# EasyEDA Pro project ProPrj_Animatronic Bird Control Carrier Board_2026-03-15.epro

# Schematic Schematic1
Board Name: Board1; Create Date: 2026-03-13; Page Name: P1; Project Name: Animatronic Bird Control Carrier Board; Schematic Name: Schematic1; Update Date: 2026-03-12; Company: EasyEDA.com; Page Size: A4; Version: V1.0
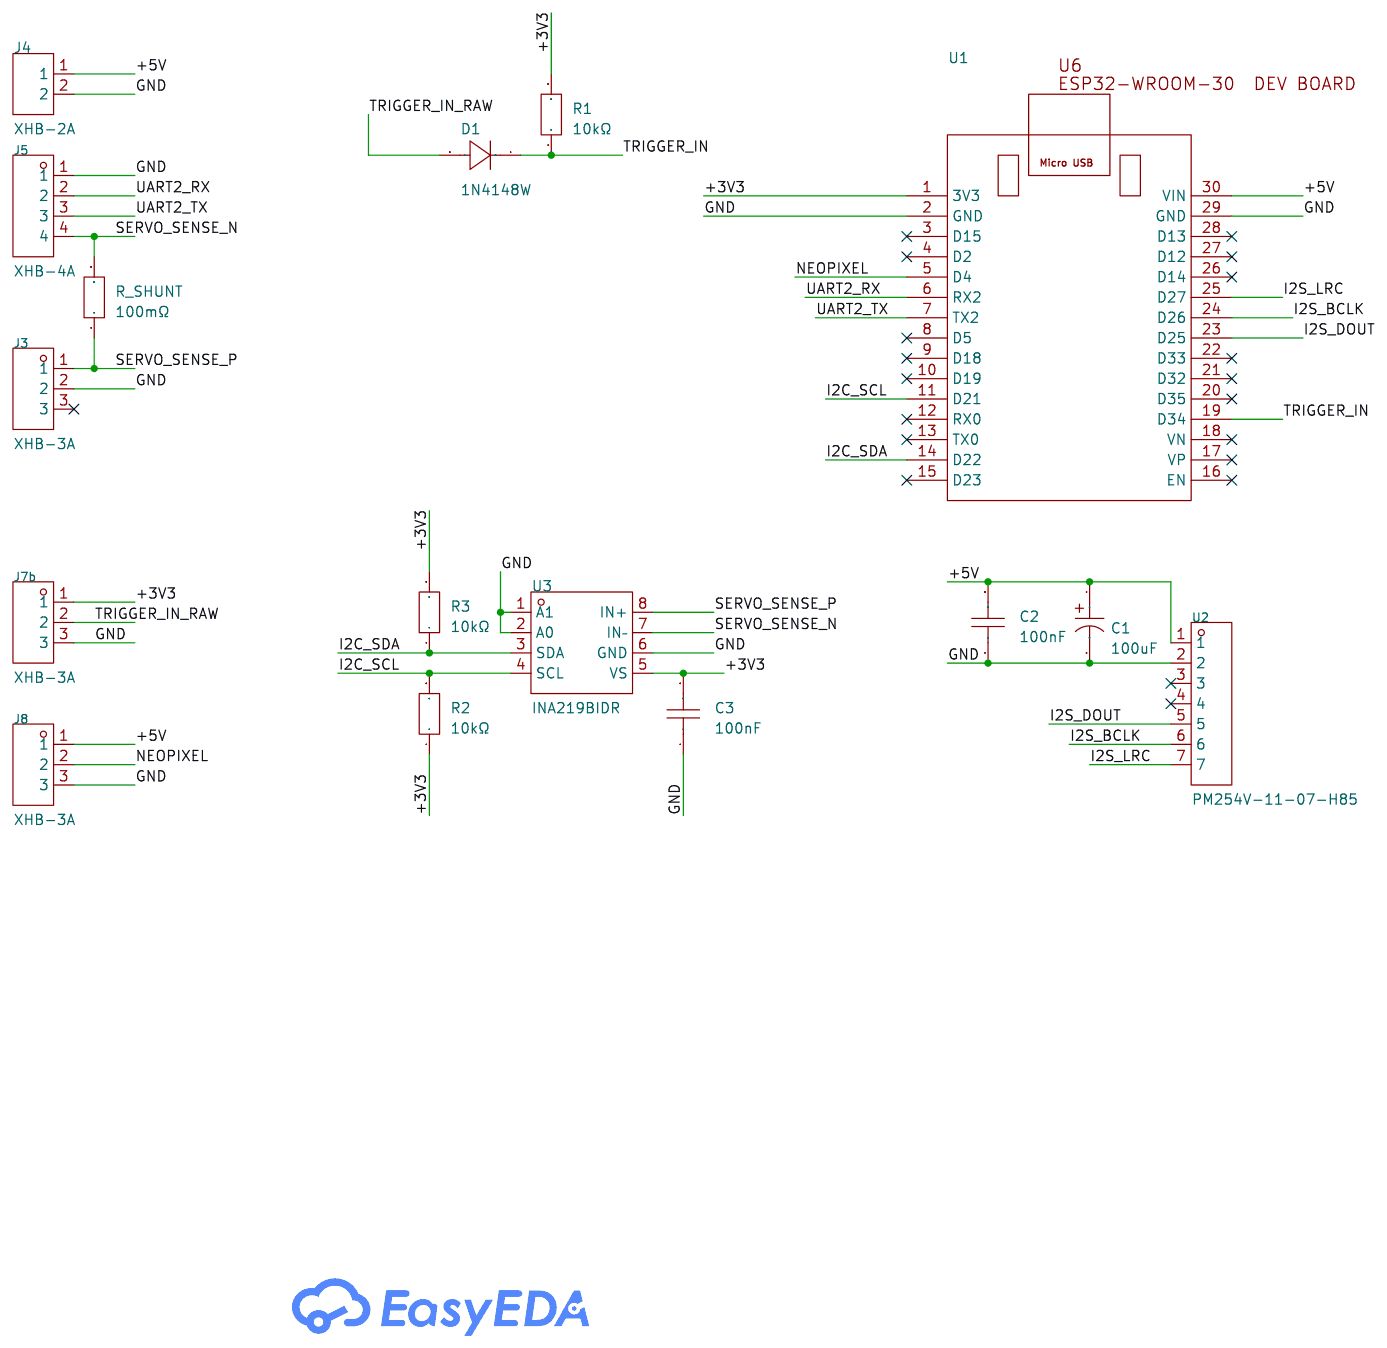
[diagram p0: schematic sheet]

## Parts
C1  100uF  [CAP-SMD_BD6.3-L6.6-W6.6-FD]
C2  100nF  [C0603]
C3  100nF  [C0603]
D1  1N4148W  [SOD-123_L2.8-W1.8-LS3.7-RD-1]
J3  XHB-3A  [CONN-TH_XHB-3A]
J4  XHB-2A  [CONN-TH_XHB-2A_C2829622]
J5  XHB-4A  [CONN-TH_4P-P2.50_HCTL_HC-XHB-4A]
J7b  XHB-3A  [CONN-TH_XHB-3A]
J8  XHB-3A  [CONN-TH_XHB-3A]
R1  10kΩ  [R0603]
R2  10kΩ  [R0603]
R3  10kΩ  [R0603]
R_SHUNT  100mΩ  [R2512]
U1  -  [ESP32-WROOM-30-DEVBOARD]
U2  PM254V-11-07-H85  [HDR-TH_7P-P2.54-V-F]
U3  INA219BIDR  [SOIC-8_L5.0-W4.0-P1.27-LS6.1-BL]

## Library data of the parts
C1 = RST100UF16V003: Capacitance:100uF Tolerance:±20% Tolerance:±20% Voltage Rating:16V Ripple Current:60mA@120Hz Equivalent Series Resistance(ESR):- Diameter:6.3mm Height - Seated (Max):5.4mm Lifetime:2000hrs@105℃ Operating Temperature:-40℃~+105℃ Operating Temperature:-40℃~+; LCSC Part Name: 100uF ±20% 16V; Supplier Part: C4747963; Manufacturer: KNSCHA(科尼盛); Supplier Footprint: SMD,D6.3xL5.4mm; JLCPCB Part Class: Extended Part; Datasheet: https://item.szlcsc.com/datasheet/RST100UF16V003/5320090.html; Supplier: LCSC; Tolerance: ±20%; Voltage Rating: 16V; Ripple Current: 60mA@120Hz; Diameter: 6.3mm; Height - Seated (Max): 5.4mm; Lifetime: 2000hrs@105℃; Operating Temperature: -40℃~+105℃
C2 C3 = CC0603KRX7R9BB104: Capacitance:100nF Tolerance:±10% Tolerance:±10% Voltage Rating:50V Temperature Coefficient:X7R; LCSC Part Name: 100nF ±10% 50V; Supplier Part: C14663; Manufacturer: YAGEO(国巨); Supplier Footprint: 0603; JLCPCB Part Class: Basic Part; Datasheet: https://item.szlcsc.com/datasheet/CC0603KRX7R9BB104/15331.html; Supplier: LCSC; Tolerance: ±10%; Voltage Rating: 50V; Temperature Coefficient: X7R
D1 = 1N4148W_C917030: Diode Configuration:Independent Voltage - Forward(Vf@If):1.25V@150mA Voltage - DC Reverse(Vr):100V Current - Rectified:300mA Pd - Power Dissipation:400mW Reverse Leakage Current (Ir):1uA@75V Reverse Recovery Time (trr):8ns Operating Junction Temperature R; Supplier Part: C917030; Manufacturer: JSMSEMI(杰盛微); Supplier Footprint: SOD-123; JLCPCB Part Class: Extended Part; Datasheet: https://item.szlcsc.com/datasheet/1N4148W/991526.html; Supplier: LCSC; Diode Configuration: Independent; Voltage - Forward(Vf@If): 1.25V@150mA; Voltage - DC Reverse(Vr): 100V; Current - Rectified: 300mA; Pd - Power Dissipation: 400mW; Reverse Leakage Current (Ir): 1uA@75V; Reverse Recovery Time (trr): 8ns; Operating Junction Temperature Range: -55℃~+150℃@(Tj); Non-Repetitive Peak Forward Surge Current: 4A
J3 J7b J8 = XHB-3A_C722899: Pins Structure:1x3P Pitch:2.5mm Mounting Type:Through Hole Reference Series:XHB Number of Pins:3P Number of Rows:1 Number of PINs Per Row:3 Row Spacing:- Current Rating:- Contact Material:Brass Contact Plating:Tin Operating Temperature:- Operating Tempera; LCSC Part Name: 1x3P 间距:2.5mm 直插 系列:XHB; Supplier Part: C722899; Manufacturer: CAX(创都); Supplier Footprint: 插件,P=2.5mm; JLCPCB Part Class: Extended Part; Datasheet: https://item.szlcsc.com/datasheet/XHB-3A/767106.html; Supplier: LCSC; Pins Structure: 1x3P; Pitch: 2.5mm; Mounting Type: Through Hole; Reference Series: XHB; Number of Pins: 3P; Number of Rows: 1; Number of PINs Per Row: 3; Contact Material: Brass; Contact Plating: Tin; Plastic Material: PA66; Flame Retardant Rating: UL94V-0; Color: White; Z-Height of the Board: 7mm; X-Length of Bottom Edge on Board (Spacing Line): 10mm; Y-Width of Bottom Edge on Board: 5.8mm
J4 = XHB-2A: Pins Structure:1x2P Pitch:2.5mm Mounting Type:Through Hole Reference Series:XHB Number of Pins:2P Number of Rows:1 Number of PINs Per Row:2 Current Rating:3A Operating Temperature:-25℃~+85℃ Operating Temperature:-25℃~+85℃ Voltage Rating:250V Color:White Z; LCSC Part Name: 1x2P 间距:2.5mm 直插 系列:XHB; Supplier Part: C2829622; Manufacturer: FG(富港); Supplier Footprint: 插件,P=2.5mm; JLCPCB Part Class: Extended Part; Datasheet: https://item.szlcsc.com/datasheet/XHB-2A/2980249.html; Supplier: LCSC; Pins Structure: 1x2P; Pitch: 2.5mm; Mounting Type: Through Hole; Reference Series: XHB; Number of Pins: 2P; Number of Rows: 1; Number of PINs Per Row: 2; Current Rating: 3A; Operating Temperature: -25℃~+85℃; Voltage Rating: 250V; Color: White; Z-Height of the Board: 7.1mm; X-Length of Bottom Edge on Board (Spacing Line): 7.5mm; Y-Width of Bottom Edge on Board: 6.35mm
J5 = XHB-4A_C2904971: Pins Structure:1x4P Pitch:2.5mm Mounting Type:Through Hole Reference Series:XHB Number of Pins:4P Number of Rows:1 Number of PINs Per Row:4 Row Spacing:- Current Rating:- Operating Temperature:-25℃~+85℃ Operating Temperature:-25℃~+85℃ Voltage Rating:50V Z; LCSC Part Name: 1x4P 间距:2.5mm 直插 系列:XHB; Supplier Part: C2904971; Manufacturer: DEALON(德艺隆); Supplier Footprint: 插件,P=2.5mm; JLCPCB Part Class: Extended Part; Datasheet: https://item.szlcsc.com/datasheet/XHB-4A/3172256.html; Supplier: LCSC; Pins Structure: 1x4P; Pitch: 2.5mm; Mounting Type: Through Hole; Reference Series: XHB; Number of Pins: 4P; Number of Rows: 1; Number of PINs Per Row: 4; Operating Temperature: -25℃~+85℃; Voltage Rating: 50V; Z-Height of the Board: 7mm; X-Length of Bottom Edge on Board (Spacing Line): 12.5mm; Y-Width of Bottom Edge on Board: 5.8mm
R1-R3 = FRC0603J103 TS: Type:Thick Film Resistor Resistance:10kΩ Tolerance:±5% Tolerance:±5% Power(Watts):100mW Voltage-Supply(Max):75V Temperature Coefficient:±100ppm/℃ Temperature Coefficient:±100ppm/℃ Operating Temperature:-55℃~+155℃ Operating Temperature:-55℃~+155℃; LCSC Part Name: 10kΩ ±5% 100mW 厚膜电阻; Supplier Part: C2930027; Manufacturer: FOJAN(富捷); Supplier Footprint: 0603; JLCPCB Part Class: Extended Part; Datasheet: https://item.szlcsc.com/datasheet/FRC0603J103%2520TS/3266960.html; Supplier: LCSC; Type: Thick Film Resistor; Tolerance: ±5%; Power(Watts): 100mW; Voltage-Supply(Max): 75V; Temperature Coefficient: ±100ppm/℃; Operating Temperature: -55℃~+155℃
R_SHUNT = LRP12FTDSR100: Resistance:100mΩ Tolerance:±1% Tolerance:±1% Power(Watts):2W Temperature Coefficient:±50ppm/℃ Temperature Coefficient:±50ppm/℃ Operating Temperature:-55℃~+170℃ Operating Temperature:-55℃~+170℃; LCSC Part Name: 100mΩ ±1% 2W; Supplier Part: C37635799; Manufacturer: Viking(光颉); Supplier Footprint: 2512; JLCPCB Part Class: Extended Part; Datasheet: https://item.szlcsc.com/datasheet/LRP12FTDSR100/39362056.html; Supplier: LCSC; Tolerance: ±1%; Power(Watts): 2W; Temperature Coefficient: ±50ppm/℃; Operating Temperature: -55℃~+170℃
U1 = ESP32-WROOM 30-pin dev board
U2 = PM254V-11-07-H85: Holes Structure:1x7P Pitch:2.54mm Row Spacing:- Circular Hole / Square Hole:Square Hole Mounting Type:Through Hole Number of Rows:1 Number of Positions:7P Current Rating:3A Voltage Rating (Max):250V Holes Direction:Top Insulation Height:- Operating Temper; LCSC Part Name: 间距:2.54mm 1x7P 直插; Supplier Part: C2832270; Manufacturer: XFCN(兴飞); Supplier Footprint: 插件,P=2.54mm; JLCPCB Part Class: Extended Part; Datasheet: https://item.szlcsc.com/datasheet/PM254V-11-07-H85/2989788.html; Supplier: LCSC; Holes Structure: 1x7P; Pitch: 2.54mm; Circular Hole / Square Hole: Square Hole; Mounting Type: Through Hole; Number of Rows: 1; Number of Positions: 7P; Current Rating: 3A; Voltage Rating (Max): 250V; Holes Direction: Top; Operating Temperature: -40℃~+105℃
U3 = INA219BIDR: Vcm - Common Mode Voltage:300mV~26V Vcm - Common Mode Voltage:300mV~26V Ib - Input Bias Current:- Vos - Input Offset Voltage:- Operating Temperature:-40℃~+125℃ Operating Temperature:-40℃~+125℃; LCSC Part Name: 具有I2C接口的零漂移双向电流/功率监测计; Supplier Part: C2155799; Manufacturer: TI(德州仪器); Supplier Footprint: SOIC-8; JLCPCB Part Class: Extended Part; Datasheet: https://www.ti.com/cn/lit/gpn/ina219; Supplier: LCSC; Vcm - Common Mode Voltage: 300mV~26V; Operating Temperature: -40℃~+125℃

## Nets
+3V3: C3.2 J7b.1 R1.2 R2.1 R3.2 U1.1(3V3) U3.5(VS)
+5V: C1.1 C2.2 J4.1 J8.1 U1.30(VIN) U2.1
GND: C1.2 C2.1 C3.1 J3.2 J4.2 J5.1 J7b.3 J8.3 U1.2(GND) U1.29(GND) U2.2 U3.1(A1) U3.2(A0) U3.6(GND)
I2C_SCL: R2.2 U1.11(D21) U3.4(SCL)
I2C_SDA: R3.1 U1.14(D22) U3.3(SDA)
I2S_BCLK: U1.24(D26) U2.6
I2S_DOUT: U1.23(D25) U2.5
I2S_LRC: U1.25(D27) U2.7
NEOPIXEL: J8.2 U1.5(D4)
SERVO_SENSE_N: J5.4 R_SHUNT.2 U3.7(IN–)
SERVO_SENSE_P: J3.1 R_SHUNT.1 U3.8(IN+)
TRIGGER_IN: D1.1(C) R1.1 U1.19(D34)
TRIGGER_IN_RAW: D1.2(A) J7b.2
UART2_RX: J5.2 U1.6(RX2)
UART2_TX: J5.3 U1.7(TX2)

Not connected (* = marked no-connect by the designer): J3 3*; U1 3(D15)* 4(D2)* 8(D5)* 9(D18)* 10(D19)* 12(RX0)* 13(TX0)* 15(D23)* 16(EN)* 17(VP)* 18(VN)* 20(D35)* 21(D32)* 22(D33)* 26(D14)* 27(D12)* 28(D13)*; U2 3* 4*

# Board PCB1
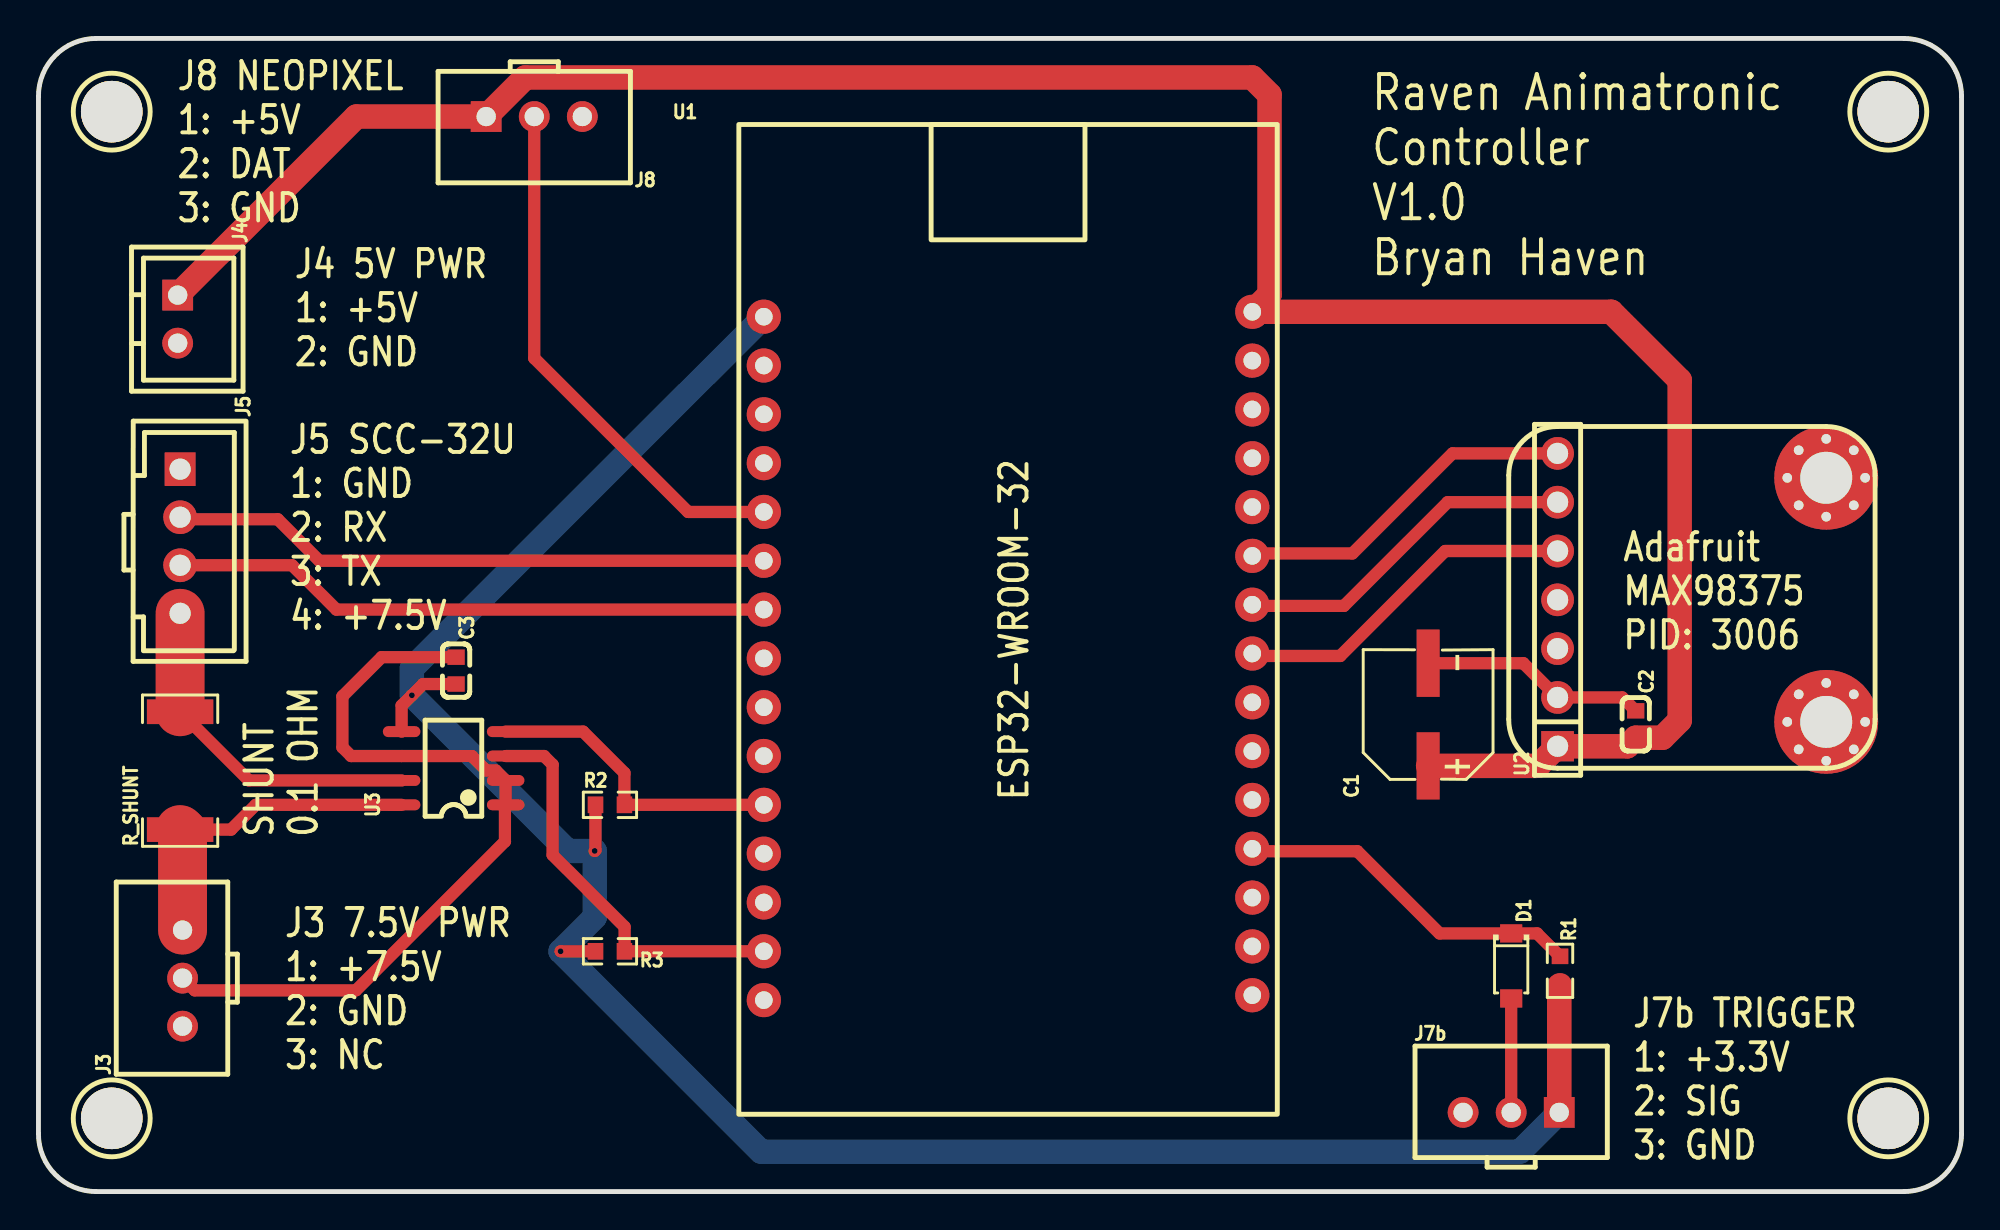
[diagram p1: board, top side]
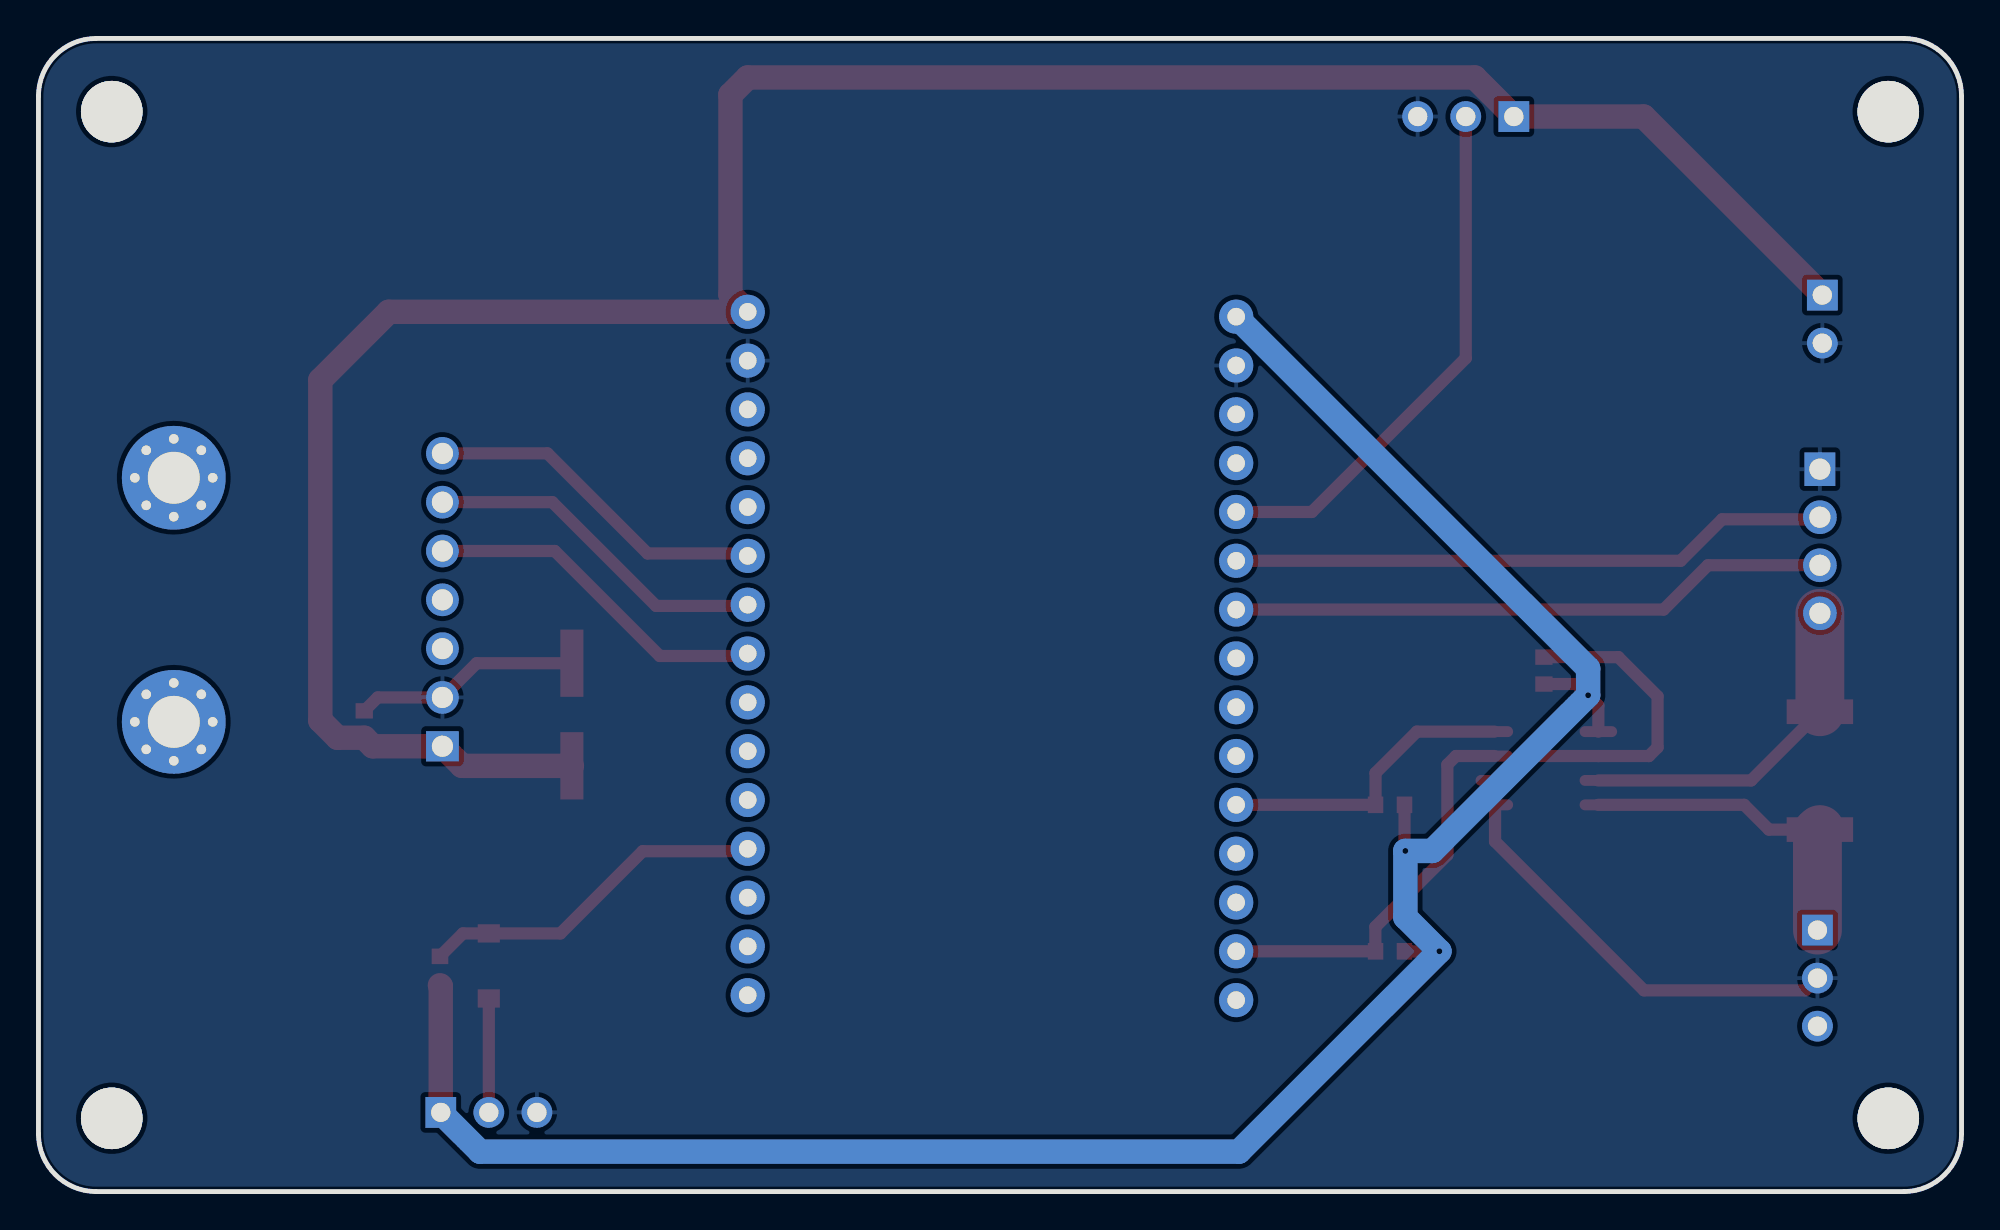
[diagram p2: board, bottom side, seen from below]

Outline 100 x 60 mm; copper layers: Top Layer, F.CrtYd, Cmts.User, Bottom Layer. Coordinates in mm from the lower left corner of the outline.
Outline path: 0,57 0,3 arc(0.88,0.88) 3,0 97,0 arc(99.12,0.88) 100,3 100,57 arc(99.12,59.12) 97,60 3,60 arc(0.88,59.12) 0,57
Stack: Top Layer 0.035mm / Dielectric1 1.51mm FR4 er 4.5 / F.CrtYd 0.035mm / Dielectric2 0.48mm PP er 4.5 / Cmts.User 0.035mm / Dielectric3 0.48mm PP er 4.5 / Bottom Layer 0.035mm

## Design rules (mm)
template: JLCPCB Capability(Two Layers Board)
spacing copperThickness1oz (default): track to track 0.102, other pairs 0.152 to 0.3
spacing copperThickness2oz: track to track 0.203, other pairs 0.152 to 0.3
track width copperThickness1oz (default): min 0.127, default 0.254, max 2.54
track width copperThickness2oz: min 0.203, default 0.254, max 2.54
differential pair differentialPair (default): width min 0.127, default 0.254, max 2.54; gap min 0.152, default 0.152
via viaSize (default): diameter min 0.5, default 0.61, max 10; hole min 0.3, default 0.305, max 6.3

## Placement (name value [footprint] x y rotation side)
C1  100uF  [CAP-SMD_BD6.3-L6.6-W6.6-FD]  72.26 24.82 90 top
C2  100nF  [C0603]  83.06 24.31 270 top
C3  100nF  [C0603]  21.72 27.11 270 top
D1  1N4148W  [SOD-123_L2.8-W1.8-LS3.7-RD-1]  76.58 11.74 270 top
J3  XHB-3A  [CONN-TH_XHB-3A]  7.49 11.1 90 top
J4  XHB-2A  [CONN-TH_XHB-2A_C2829622]  7.24 45.39 270 top
J5  XHB-4A  [CONN-TH_4P-P2.50_HCTL_HC-XHB-4A]  7.37 33.84 270 top
J7b  XHB-3A  [CONN-TH_XHB-3A]  76.58 4.12 0 top
J8  XHB-3A  [CONN-TH_XHB-3A]  25.78 55.94 180 top
R1  10kΩ  [R0603]  79.12 11.49 270 top
R2  10kΩ  [R0603]  29.72 20.12 0 top
R3  10kΩ  [R0603]  29.72 12.5 180 top
R_SHUNT  100mΩ  [R2512]  7.37 21.9 90 top
U1  -  [ESP32-WROOM-30-DEVBOARD]  37.72 45.52 0 top
U2  PM254V-11-07-H85  [HDR-TH_7P-P2.54-V-F]  78.99 30.79 90 top
U3  INA219BIDR  [SOIC-8_L5.0-W4.0-P1.27-LS6.1-BL]  21.59 22.03 90 top
U4  -  [MountingHole_3.2mm_M3]  96.19 56.19 0 top
U5  -  [MountingHole_3.2mm_M3]  96.19 3.81 0 top
U6  -  [MountingHole_3.2mm_M3]  3.81 3.81 0 top
U7  -  [MountingHole_3.2mm_M3]  3.81 56.19 0 top
U8  -  [MountingHole:MountingHole_2.7mm_M2.5_Pad_Via]  92.96 37.14 0 top
U9  -  [MountingHole:MountingHole_2.7mm_M2.5_Pad_Via]  92.96 24.44 0 top

## Footprints (pads in the part's own frame, mm; a bottom-side part is the same pattern mirrored in y, then rotated)
C0603
  rect 0.8x0.9 smd: 1(-0.7,0) 2(0.7,0)
CAP-SMD_BD6.3-L6.6-W6.6-FD
  rect 3.5x1.2 smd: 1(-2.67,0) 2(2.67,0)
CONN-TH_4P-P2.50_HCTL_HC-XHB-4A
  rect 1.75x1.6 hole 1.1: 1(-3.75,0)
  round 1.75 hole 1.1: 2(-1.25,0) 3(1.25,0) 4(3.75,0)
CONN-TH_XHB-2A_C2829622
  rect 1.6x1.6 hole 1: 1(-1.25,0)
  round 1.6 hole 1: 2(1.25,0)
CONN-TH_XHB-3A
  rect 1.6x1.6 hole 1: 1(2.5,0)
  round 1.6 hole 1: 2(0,0) 3(-2.5,0)
ESP32-WROOM-30-DEVBOARD
  round 1.778 hole 0.914: 1(0,0) 2(0,-2.54) 3(0,-5.08) 4(0,-7.62) 5(0,-10.16) 6(0,-12.7) 7(0,-15.24) 8(0,-17.78) 9(0,-20.32) 10(0,-22.86) 11(0,-25.4) 12(0,-27.94) 13(0,-30.48) 14(0,-33.02) 15(0,-35.56) 16(25.4,-35.306) 17(25.4,-32.766) 18(25.4,-30.226) 19(25.4,-27.686) 20(25.4,-25.146) 21(25.4,-22.606) 22(25.4,-20.066) 23(25.4,-17.526) 24(25.4,-14.986) 25(25.4,-12.446) 26(25.4,-9.906) 27(25.4,-7.366) 28(25.4,-4.826) 29(25.4,-2.286) 30(25.4,0.254)
HDR-TH_7P-P2.54-V-F
  rect 1.575x1.7 hole 1.1: 1(-7.62,0)
  round 1.7 hole 1.1: 2(-5.08,0) 3(-2.54,0) 4(0,0) 5(2.54,0) 6(5.08,0) 7(7.62,0)
MountingHole:MountingHole_2.7mm_M2.5_Pad_Via
  round 0.8 hole 0.5: 1(0,2.025) 2(2.025,0) 3(0,-2.025) 4(-1.432,1.432) 5(1.432,-1.432) 6(1.432,1.432) 7(-1.432,-1.432) 8(-2.025,0)
  round 5.4 hole 2.7: 9(0,0)
MountingHole_3.2mm_M3
  round 3.2 hole 3.2: (0,0)
R0603
  rect 0.806x0.864 smd: 1(-0.753,0) 2(0.753,0)
R2512
  rect 1.282x3.456 smd: 1(-3.067,0) 2(3.067,0)
SOD-123_L2.8-W1.8-LS3.7-RD-1
  rect 0.95x1.15 smd: 1(-1.692,0) 2(1.692,0)
SOIC-8_L5.0-W4.0-P1.27-LS6.1-BL
  oval 0.569x1.95 smd: 1(-1.905,-2.705) 2(-0.635,-2.705) 3(0.635,-2.705) 4(1.905,-2.705) 5(1.905,2.705) 6(0.635,2.705) 7(-0.635,2.705) 8(-1.905,2.705)

## Nets
As in the schematic.

Pads without a net: J3 3; U1 3 4 8 9 10 12 13 15 16 17 18 20 21 22 26 27 28; U2 3 4; U8 1 2 3 4 5 6 7 8 9; U9 1 2 3 4 5 6 7 8 9

## Via types
v1: diameter 0.61, hole 0.305, Top Layer to Bottom Layer, 3 vias

## Routing (per net, layer and track width the routed paths; a pad name or vN(x,y) marks a point on that pad's centre or on a via; arc(x,y) is an arc through that point)
+3V3: length 118.7
  Top Layer w0.635: U3.5 18.89,25.29 v1(19.42,25.82) 20,26.41 C3.2 ; R2.1 28.96,17.77 v1(28.92,17.72) ; R3.2 v1(27.15,12.5)
  Top Layer w1.27: R1.2 79.08,10.69 J7b.1
  Bottom Layer w1.27: U1.1 19.42,27.22 v1(19.42,25.82) 27.52,17.72 v1(28.92,17.72) 28.92,14.27 v1(27.15,12.5) 37.58,2.08 77.04,2.08 J7b.1
+5V: length 129
  Top Layer w1.27: C1.1 77.97,22.15 U2.1 82.62,23.17 C2.2 84.45,23.61 85.34,24.51 85.34,42.22 81.79,45.78 U1.30 64.02,46.67 64.02,57.07 63.12,57.97 25.31,57.97 J8.1 16.53,55.94 J4.1
GND: length 53.9
  Top Layer w0.635: C2.1 82.36,25.71 U2.2 77.21,27.49 C1.2 ; C3.1 17.84,27.81 15.81,25.77 15.81,23.11 16.26,22.66 22.54,22.66 23.29,21.91 23.78,21.91 U3.2 U3.1 24.26,20.08 24.26,18.22 16.51,10.47 8.13,10.47 J3.2
I2C_SCL: length 15.8
  Top Layer w0.635: U3.4 28.32,23.93 30.47,21.78 R2.2 ; U1.11 30.6,20.12
I2C_SDA: length 21
  Top Layer w0.635: 30.6,12.5 U1.14 ; R3.1 30.48,12.51 30.48,13.77 26.74,17.51 26.74,22.21 26.29,22.66 24.3,22.66
I2S_BCLK: length 18.1
  Top Layer w0.635: 63.12,30.54 63.18,30.47 67.88,30.47 73.28,35.87 U2.6
I2S_DOUT: length 18.2
  Top Layer w0.635: U2.5 73.15,33.33 67.69,27.87 63.25,27.87 U1.23
I2S_LRC: length 18.1
  Top Layer w0.635: U2.7 73.53,38.41 68.33,33.2 63.25,33.2 U1.25
NEOPIXEL: length 27.8
  Top Layer w0.635: J8.2 25.78,43.36 33.78,35.36 U1.5
SERVO_SENSE_N: length 18.1
  Top Layer w0.635: U3.7 10.94,21.39 R_SHUNT.2
  Top Layer w2.54: J5.4 R_SHUNT.2
SERVO_SENSE_P: length 17.3
  Top Layer w0.635: U3.8 11.3,20.12 10.01,18.83 R_SHUNT.1
  Top Layer w2.54: J3.1 7.49,18.71 R_SHUNT.1
TRIGGER_IN: length 18.3
  Top Layer w0.635: R1.1 77.93,13.43 D1.1 72.86,13.43 68.58,17.71 63.25,17.71 63.12,17.84
TRIGGER_IN_RAW: length 5.9
  Top Layer w0.635: J7b.2 D1.2
UART2_RX: length 31.3
  Top Layer w0.635: J5.2 7.47,34.98 12.45,34.98 14.61,32.82 U1.6
UART2_TX: length 31.3
  Top Layer w0.635: J5.3 13.19,32.59 15.49,30.28 U1.7

## Copper pours and planes (outline as drawn; the poured copper is in the pictures)
GND on Bottom Layer: 0,57 0.01,57.26 0.06,57.61 0.15,57.94 0.28,58.27 0.45,58.57 0.65,58.86 0.88,59.12 1.14,59.35 1.43,59.55 1.73,59.72 2.06,59.85 2.39,59.94 2.74,59.99 3,60 97,60 97.26,59.99 97.61,59.94 97.94,59.85 98.27,59.72 98.57,59.55 98.86,59.35 99.12,59.12 99.35,58.86 99.55,58.57 99.72,58.27 99.85,57.94 99.94,57.61 99.99,57.26 100,57 100,3 99.99,2.74 99.94,2.39 99.85,2.06 99.72,1.73 99.55,1.43 99.35,1.14 99.12,0.88 98.86,0.65 98.57,0.45 98.27,0.28 97.94,0.15 97.61,0.06 97.26,0.01 97,0 3,0 2.74,0.01 2.39,0.06 2.06,0.15 1.73,0.28 1.43,0.45 1.14,0.65 0.88,0.88 0.65,1.14 0.45,1.43 0.28,1.73 0.15,2.06 0.06,2.39 0.01,2.74 0,3

## Text on the board
Top Silkscreen Layer: J8 NEOPIXEL / 1: +5V / 2: DAT / 3: GND | J3 7.5V PWR / 1: +7.5V / 2: GND / 3: NC | J5 SCC-32U / 1: GND / 2: RX / 3: TX / 4: +7.5V | J4 5V PWR / 1: +5V / 2: GND | Adafruit / MAX98375 / PID: 3006 | J7b TRIGGER / 1: +3.3V / 2: SIG / 3: GND | SHUNT / 0.1 OHM | ESP32-WROOM-32 | Raven Animatronic / Controller / V1.0 / Bryan Haven
